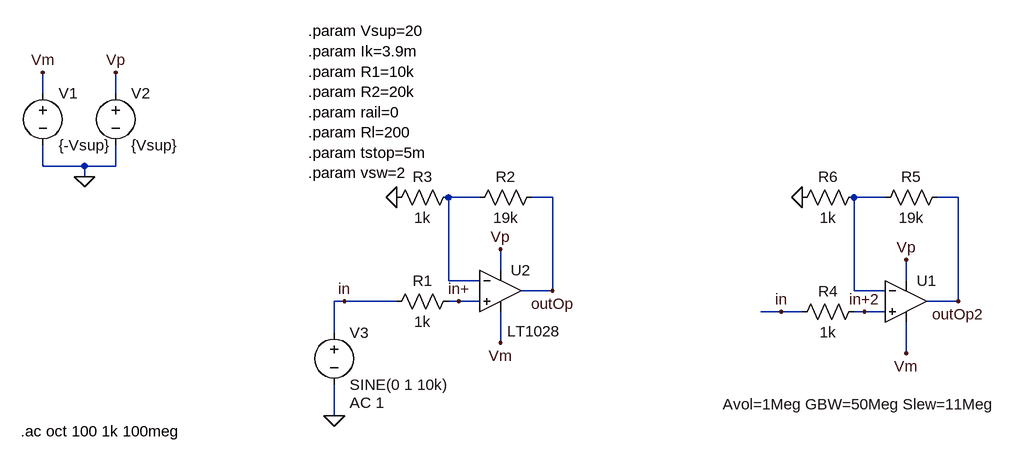
[diagram p0: schematic Draft4.asc]
Draft4.asc, the LTspice schematic file:
Version 4
SHEET 1 880 724
WIRE -2464 -96 -2464 -128
WIRE -2352 -96 -2352 -128
WIRE -2464 16 -2464 -16
WIRE -2400 16 -2464 16
WIRE -2352 16 -2352 -16
WIRE -2352 16 -2400 16
WIRE -2400 32 -2400 16
WIRE -1792 64 -1840 64
WIRE -1680 64 -1712 64
WIRE -1168 64 -1216 64
WIRE -1056 64 -1088 64
WIRE -1760 176 -1760 144
WIRE -1840 192 -1840 64
WIRE -1792 192 -1840 192
WIRE -1136 192 -1136 160
WIRE -1680 208 -1680 64
WIRE -1680 208 -1728 208
WIRE -1216 208 -1216 64
WIRE -1168 208 -1216 208
WIRE -2000 224 -2016 224
WIRE -1920 224 -2000 224
WIRE -1824 224 -1840 224
WIRE -1792 224 -1824 224
WIRE -1056 224 -1056 64
WIRE -1056 224 -1104 224
WIRE -1328 240 -1360 240
WIRE -1296 240 -1328 240
WIRE -1200 240 -1216 240
WIRE -1168 240 -1200 240
WIRE -2016 272 -2016 224
WIRE -1760 288 -1760 240
WIRE -1136 304 -1136 256
WIRE -2016 400 -2016 352
FLAG -2000 224 in
FLAG -2400 32 0
FLAG -2464 -128 Vm
FLAG -2352 -128 Vp
FLAG -2016 400 0
FLAG -1680 208 outOp
FLAG -1760 144 Vp
FLAG -1760 288 Vm
FLAG -1824 224 in+
FLAG -1920 64 0
FLAG -1056 224 outOp2
FLAG -1136 160 Vp
FLAG -1136 304 Vm
FLAG -1200 240 in+2
FLAG -1296 64 0
FLAG -1328 240 in
SYMBOL res -1824 208 R90
WINDOW 0 0 56 VBottom 2
WINDOW 3 32 56 VTop 2
SYMATTR InstName R1
SYMATTR Value 1k
SYMBOL voltage -2464 -112 R0
WINDOW 123 0 0 Left 2
WINDOW 39 0 0 Left 2
SYMATTR InstName V1
SYMATTR Value {-Vsup}
SYMBOL voltage -2352 -112 R0
WINDOW 123 0 0 Left 2
WINDOW 39 0 0 Left 2
SYMATTR InstName V2
SYMATTR Value {Vsup}
SYMBOL voltage -2016 256 R0
WINDOW 123 24 124 Left 2
WINDOW 39 0 0 Left 2
SYMATTR Value2 AC 1
SYMATTR InstName V3
SYMATTR Value SINE(0 1 10k)
SYMBOL Opamps\\LT1028 -1760 144 R0
WINDOW 3 10 126 Left 2
SYMATTR InstName U2
SYMBOL res -1696 48 R90
WINDOW 0 0 56 VBottom 2
WINDOW 3 32 56 VTop 2
SYMATTR InstName R2
SYMATTR Value 19k
SYMBOL res -1824 48 R90
WINDOW 0 0 56 VBottom 2
WINDOW 3 32 56 VTop 2
SYMATTR InstName R3
SYMATTR Value 1k
SYMBOL Opamps\\UniversalOpamp2 -1136 224 R0
WINDOW 123 -282 158 Left 2
SYMATTR InstName U1
SYMATTR SpiceLine ilimit=25m rail={rail} Vos=0 phimargin=45
SYMATTR Value2 Avol=1Meg GBW=50Meg Slew=11Meg
SYMBOL res -1200 224 R90
WINDOW 0 0 56 VBottom 2
WINDOW 3 32 56 VTop 2
SYMATTR InstName R4
SYMATTR Value 1k
SYMBOL res -1072 48 R90
WINDOW 0 0 56 VBottom 2
WINDOW 3 32 56 VTop 2
SYMATTR InstName R5
SYMATTR Value 19k
SYMBOL res -1200 48 R90
WINDOW 0 0 56 VBottom 2
WINDOW 3 32 56 VTop 2
SYMATTR InstName R6
SYMATTR Value 1k
TEXT -2056 -192 Left 2 !.param Vsup=20\n.param Ik=3.9m\n.param R1=10k\n.param R2=20k\n.param rail=0\n.param Rl=200\n.param tstop=5m\n.param vsw=2
TEXT -2498 424 Left 2 !.ac oct 100 1k 100meg

The netlist it stands for:
* Draft4.asc
R1 in+ in 1k
V1 Vm 0 {-Vsup}
V2 Vp 0 {Vsup}
V3 in 0 SINE(0 1 10k) AC 1
XU2 in+ N001 Vp Vm outOp LT1028  ; pins In+ In- V+ V- OUT
R2 outOp N001 19k
R3 N001 0 1k
XU1 in+2 N002 Vp Vm outOp2 level.2 Avol=1Meg GBW=50Meg Slew=11Meg ilimit=25m rail={rail} Vos=0 phimargin=45 en=0 enk=0 in=0 ink=0 Rin=500Meg  ; pins IN+ IN- V+ V- OUT
R4 in+2 in 1k
R5 outOp2 N002 19k
R6 N002 0 1k
.param Vsup=20
.param Ik=3.9m
.param R1=10k
.param R2=20k
.param rail=0
.param Rl=200
.param tstop=5m
.param vsw=2
.ac oct 100 1k 100meg
.lib LTC.lib
.lib UniversalOpamps2.sub
.backanno
.end